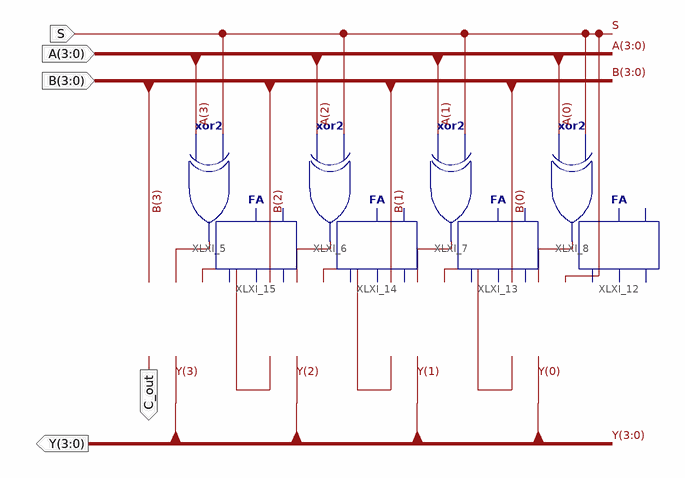
[diagram p0: schematic sheet 1]
// Xilinx ISE schematic Add_sub_unit_4bit.sch (spartan3e) as structural Verilog: 8 symbols, 5 ports
module Add_sub_unit_4bit (
  input  [3:0] A,
  input  [3:0] B,
  input  S,
  output C_out,
  output [3:0] Y
);

  wire XLXN_1, XLXN_2, XLXN_3, XLXN_4, XLXN_74, XLXN_75, XLXN_76;

  xor XLXI_5 (XLXN_1, A[3], S);
  xor XLXI_6 (XLXN_2, A[2], S);
  xor XLXI_7 (XLXN_3, A[1], S);
  xor XLXI_8 (XLXN_4, A[0], S);
  FA XLXI_12 (.A(B[0]), .B(XLXN_4), .C_in(S), .C_out(XLXN_76), .S(Y[0]));
  FA XLXI_13 (.A(B[1]), .B(XLXN_3), .C_in(XLXN_76), .C_out(XLXN_75), .S(Y[1]));
  FA XLXI_14 (.A(B[2]), .B(XLXN_2), .C_in(XLXN_75), .C_out(XLXN_74), .S(Y[2]));
  FA XLXI_15 (.A(B[3]), .B(XLXN_1), .C_in(XLXN_74), .C_out(C_out), .S(Y[3]));
endmodule
